# Altium schematic sheet ZIGBEE.SchDoc
size A4; SheetNumber: 6; SheetTotal: 10
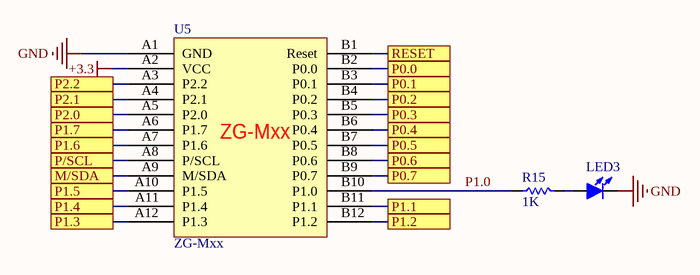
[diagram p0: ZIGBEE.SchDoc]

## Parts
LED3  LED-SMD  [LED 0805B]  (value not drawn)
R15  1K  [R 0805]
U5  ZG-Mxx  [ZG-M0/M1/M1E]

## Ports
M/SDA, P0.0, P0.1, P0.2, P0.3, P0.4, P0.5, P0.6, P0.7, P1.1, P1.2, P1.3, P1.4, P1.5, P1.6, P1.7, P2.0, P2.1, P2.2, P/SCL, RESET

## Nets
+3.3: U5.A2(VCC)
GND: LED3.2(K) U5.A1(GND)
M/SDA: U5.A9(M/SDA) ; port M/SDA
P0.0: U5.B2(P0.0) ; port P0.0
P0.1: U5.B3(P0.1) ; port P0.1
P0.2: U5.B4(P0.2) ; port P0.2
P0.3: U5.B5(P0.3) ; port P0.3
P0.4: U5.B6(P0.4) ; port P0.4
P0.5: U5.B7(P0.5) ; port P0.5
P0.6: U5.B8(P0.6) ; port P0.6
P0.7: U5.B9(P0.7) ; port P0.7
P1.0: R15.1 U5.B10(P1.0)
P1.1: U5.B11(P1.1) ; port P1.1
P1.2: U5.B12(P1.2) ; port P1.2
P1.3: U5.A12(P1.3) ; port P1.3
P1.4: U5.A11(P1.4) ; port P1.4
P1.5: U5.A10(P1.5) ; port P1.5
P1.6: U5.A7(P1.6) ; port P1.6
P1.7: U5.A6(P1.7) ; port P1.7
P2.0: U5.A5(P2.0) ; port P2.0
P2.1: U5.A4(P2.1) ; port P2.1
P2.2: U5.A3(P2.2) ; port P2.2
P/SCL: U5.A8(P/SCL) ; port P/SCL
RESET: U5.B1(Reset) ; port RESET
NetLED3_1: LED3.1(A) R15.2

## Library data of the parts
LED3 = LED-SMD: Patch LED; BOM名称: 贴片LED; 版权归属: 源创客; 学习资源: www.ooocke.com
R15 = R: Chip resistor; 版权归属: 源创客; BOM名称: Chip resistor; 学习资源: www.ooocke.com
U5 = ZG-Mxx: Zigbee Ghostyu